# Altium schematic sheet DE-180824_1.SchDoc: DimmerBaseBoard
size A3; Author: eldar6776@hotmail.com; DrawnBy: Eldar Dedic; Organization: JUBERA d.o.o.; Address1: Braće Mulić 81; Address2: 71000 Sarajevo; Address3: Federacija BiH; Address4: Bosna i Hercegovina; DocumentNumber: DE-180824; Revision: 001; SheetNumber: 2; SheetTotal: 2; SPICEModelCacheBVBUIEPD: <root> / <DocumentId>BVBUIEPD</DocumentId> / </root>
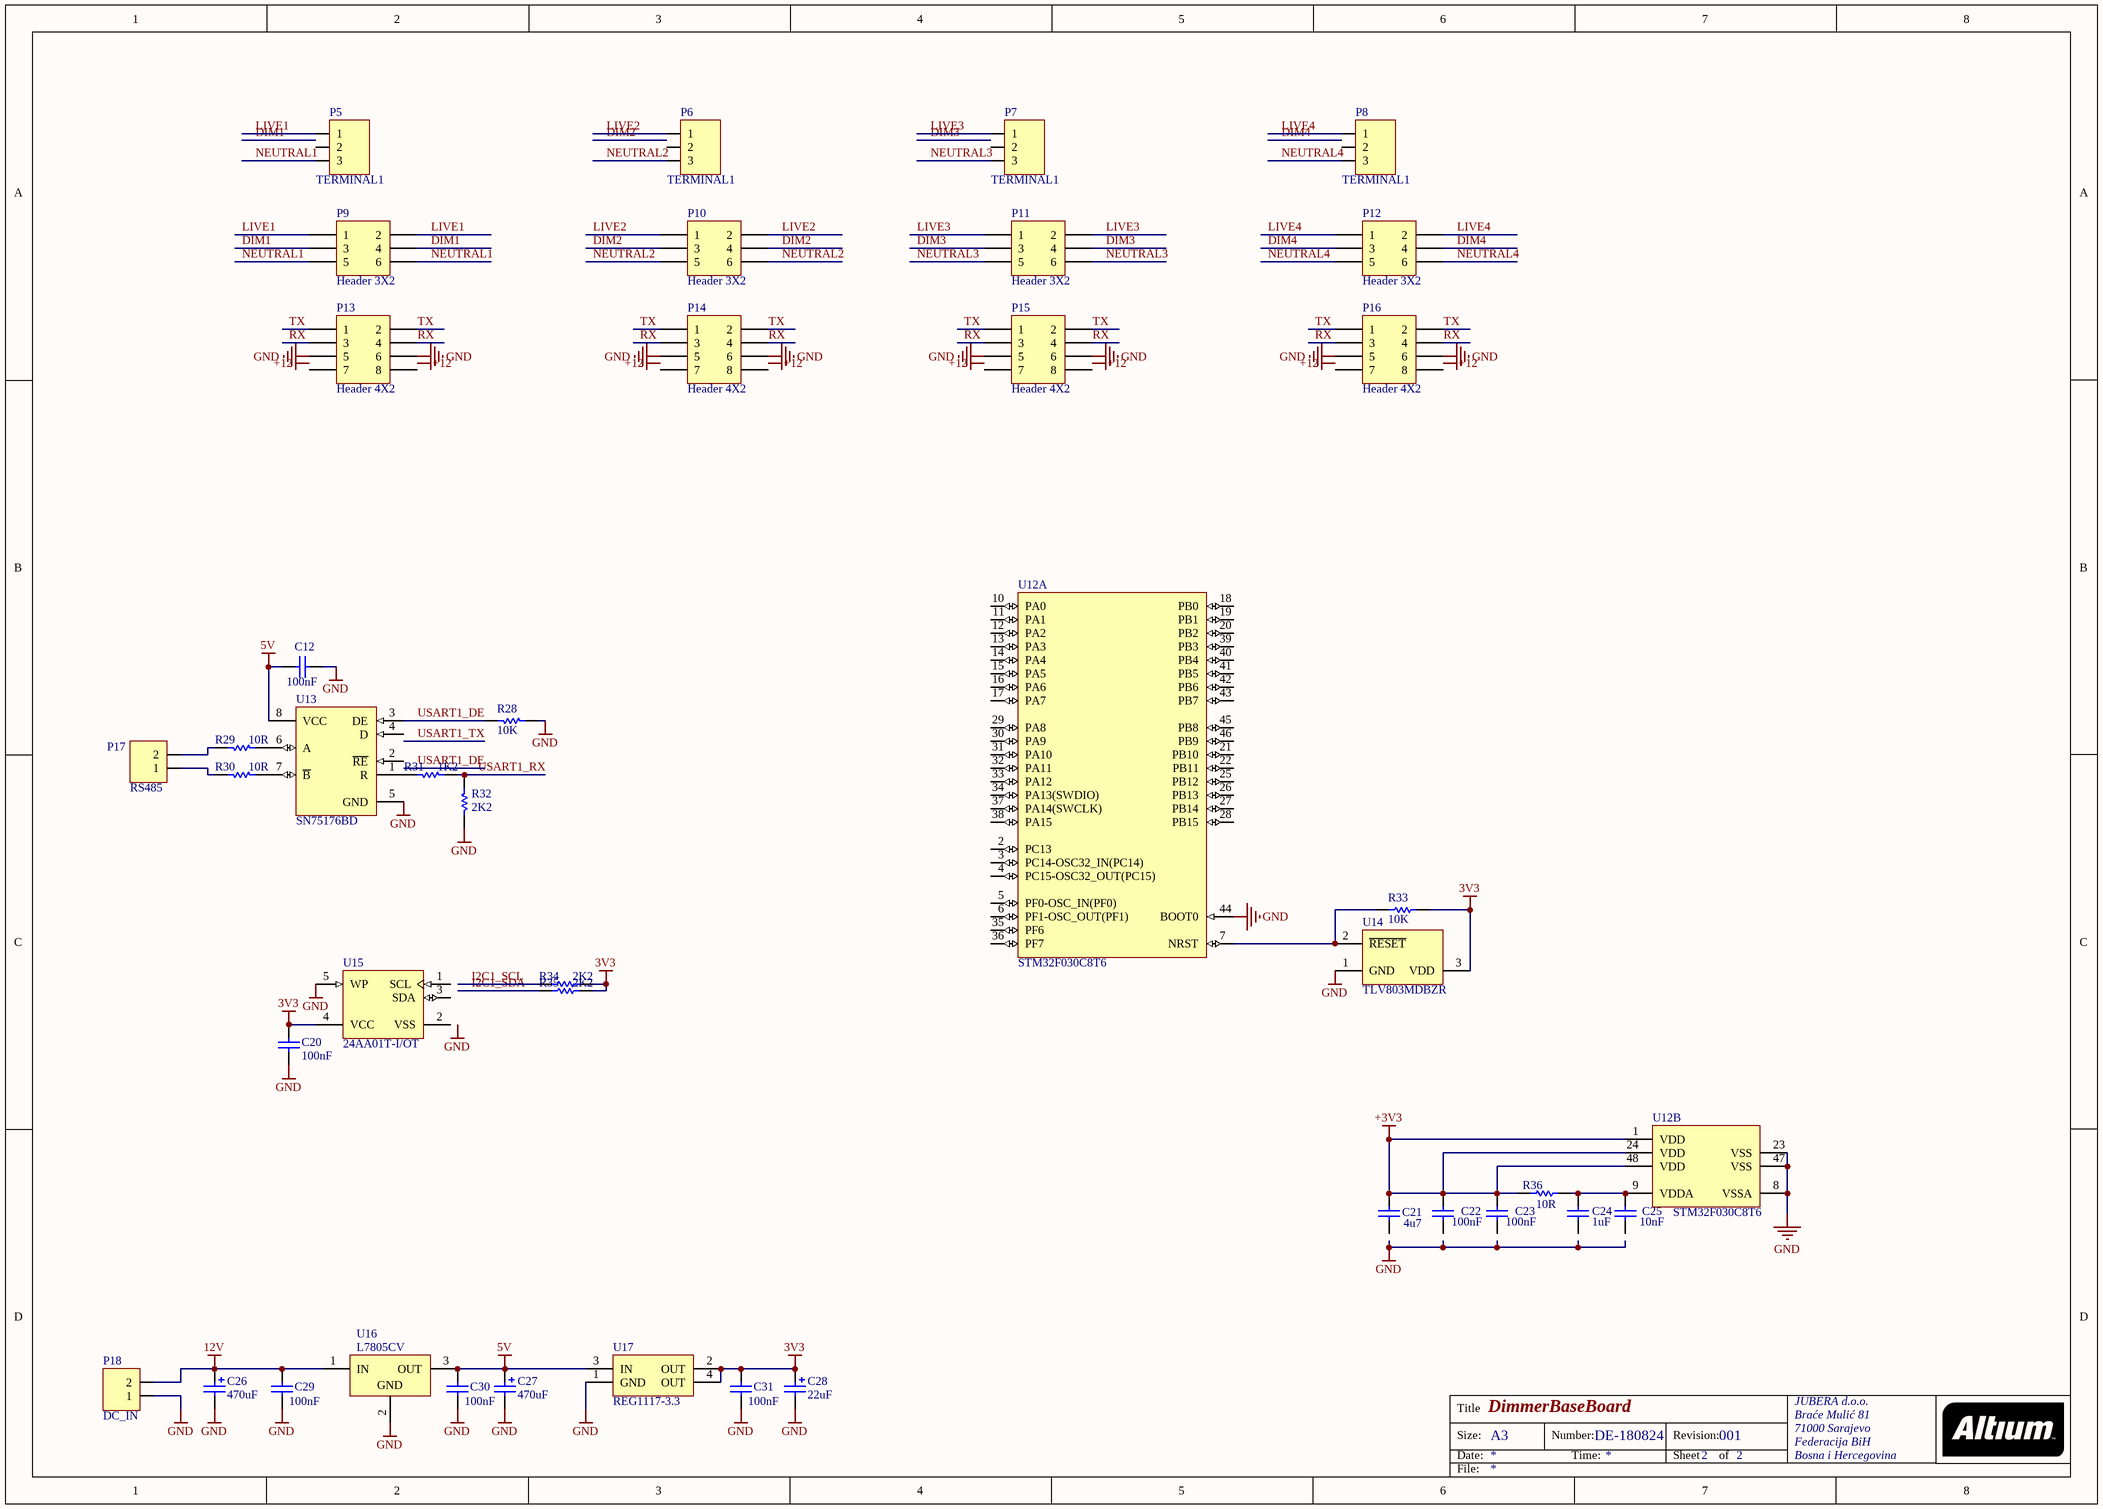
[diagram p0: DE-180824_1.SchDoc]

## Parts
C12  100nF  [0603]
C20  value 100nF  [0603]  (hidden comment: C0603)
C21  4u7  [0805]
C22  100nF  [0603]
C23  100nF  [0603]
C24  1uF  [0603]
C25  10nF  [0603]
C26  470uF  [CAPPR5-10X12.5]
C27  470uF  [CAPPR5-10X12.5]
C28  22uF  [CAPPR2-5X11]
C29  100nF  [0603]
C30  100nF  [0603]
C31  100nF  [0603]
P5  TERMINAL1  [3 PIN TERMINAL BLOCK  5mm]
P6  TERMINAL1  [3 PIN TERMINAL BLOCK  5mm]
P7  TERMINAL1  [3 PIN TERMINAL BLOCK  5mm]
P8  TERMINAL1  [3 PIN TERMINAL BLOCK  5mm]
P9  Header 3X2  [HDR2X3]
P10  Header 3X2  [HDR2X3]
P11  Header 3X2  [HDR2X3]
P12  Header 3X2  [HDR2X3]
P13  Header 4X2  [HDR2X4]
P14  Header 4X2  [HDR2X4]
P15  Header 4X2  [HDR2X4]
P16  Header 4X2  [HDR2X4]
P17  RS485  [TERMINAL BLOK 2]
P18  DC_IN  [TERMINAL BLOK 2]
R28  10K  [ERA-0603]
R29  10R  [ERA-0603]
R30  10R  [ERA-0603]
R31  1K2  [ERA-0603]
R32  2K2  [ERA-0603]
R33  10K  [ERA-0603]
R34  2K2  [ERA-0603]
R35  2K2  [ERA-0603]
R36  10R  [ERA-0603]
U12  STM32F030C8T6  [STM-LQFP48_N]  (parts A,B of 2)
U13  SN75176BD  [D008_N]
U14  TLV803MDBZR  [DBZ3_N]
U15  24AA01T-I/OT  [SOT-23-OT5_N]
U16  L7805CV  [TO220]
U17  REG1117-3.3  [ZZ311]

## Nets
3V3: C20.2 C28.1 C31.2 R33.2 R34.2 R35.2 U14.3(VDD) U15.4(VCC) U17.2(OUT) U17.4(OUT)
5V: C12.1 C27.1 C30.2 U13.8(VCC) U16.3(OUT) U17.3(IN)
12V: C26.1 C29.2 P18.2 U16.1(IN)
+3V3: C21.1 C22.1 C23.1 R36.2 U12.1(VDD) U12.24(VDD) U12.48(VDD)
GND: C12.2 C20.1 C26.2 C27.2 C28.2 C29.1 C30.1 C31.1 P13.5 P13.6 P14.5 P14.6 P15.5 P15.6 P16.5 P16.6 P18.1 R28.1 R32.2 U12.8(VSSA) U12.23(VSS) U12.44(BOOT0) U12.47(VSS) U13.5(GND) U14.1(GND) U15.5(WP) U16.2(GND) U17.1(GND)
DIM1: P9.3 P9.4
DIM2: P10.3 P10.4
DIM3: P11.3 P11.4
DIM4: P12.3 P12.4
I2C1_SCL: R34.1
I2C1_SDA: R35.1
LIVE1: P5.1 P9.1 P9.2
LIVE2: P6.1 P10.1 P10.2
LIVE3: P7.1 P11.1 P11.2
LIVE4: P8.1 P12.1 P12.2
NEUTRAL1: P5.3 P9.5 P9.6
NEUTRAL2: P6.3 P10.5 P10.6
NEUTRAL3: P7.3 P11.5 P11.6
NEUTRAL4: P8.3 P12.5 P12.6
RX: P13.3 P13.4 P14.3 P14.4 P15.3 P15.4 P16.3 P16.4
TX: P13.1 P13.2 P14.1 P14.2 P15.1 P15.2 P16.1 P16.2
USART1_DE: R28.2 U13.3(DE)
USART1_RX: R31.1 R32.1
NetC24_1: C24.1 C25.1 R36.1 U12.9(VDDA)
NetP17_1: P17.1 R30.1
NetP17_2: P17.2 R29.1
NetR29_2: R29.2 U13.6(A)
NetR30_2: R30.2 U13.7(~{B})
NetR31_2: R31.2 U13.1(R)
NetR33_1: R33.1 U12.7(NRST) U14.2(~{RESET})

Not connected (* = marked no-connect by the designer): C21 2; C22 2; C23 2; C24 2; C25 2; P5 2; P6 2; P7 2; P8 2; P13 7 8; P14 7 8; P15 7 8; P16 7 8; U12 2(PC13) 3(PC14-OSC32_IN(PC14)) 4(PC15-OSC32_OUT(PC15)) 5(PF0-OSC_IN(PF0)) 6(PF1-OSC_OUT(PF1)) 10(PA0) 11(PA1) 12(PA2) 13(PA3) 14(PA4) 15(PA5) 16(PA6) 17(PA7) 18(PB0) 19(PB1) 20(PB2) 21(PB10) 22(PB11) 25(PB12) 26(PB13) 27(PB14) 28(PB15) 29(PA8) 30(PA9) 31(PA10) 32(PA11) 33(PA12) 34(PA13(SWDIO)) 35(PF6) 36(PF7) 37(PA14(SWCLK)) 38(PA15) 39(PB3) 40(PB4) 41(PB5) 42(PB6) 43(PB7) 45(PB8) 46(PB9); U13 2(~{RE}) 4(D); U15 1(SCL) 2(VSS) 3(SDA)

## Notes on the sheet
- Labels drawn without touching a wire or pin: +12, GND
- Title
- Size:
- Date:
- A3
- Number:
- Time:
- Revision:
- Sheet
- of
- File:

## Library data of the parts
C12 C20 C22-C25 C29-C31 = C0603: Ceramic Chip Capacitor - Standard; Note: Footprint corresponds to dimensions for bulk cassette packaging. This case size has tightened tolerances.; Published: 17-Jul-2002; LatestRevisionDate: 19-Mar-2004; LatestRevisionNote: Silkscreen size reduced.; DatasheetDocument: Mar-2001; PackageDocument: Mar-2001; PackageReference: 0603; Publisher: Altium Limited; Code_JEITA: 0603; Code_IPC: 1608 [0603]; ComponentLink1Description: Manufacturer Link; ComponentLink1URL: http://www.kemet.com/; ComponentLink2Description: Datasheet; ComponentLink2URL: http://www.kemet.com/kemet/web/homepage/kechome.nsf/vapubfilesname/F3102TA.pdf/$file/F3102TA.pdf
  C12 C22 C23 C29-C31: Value: 100nF
  C24: Value: 1uF
  C25: Value: 10nF
C21 = C0805: Ceramic Chip Capacitor - Standard; Note: Footprint corresponds to dimensions for bulk cassette packaging. This case size has tightened tolerances.; Published: 17-Jul-2002; LatestRevisionDate: 19-Mar-2004; LatestRevisionNote: Silkscreen size reduced.; DatasheetDocument: Mar-2001; PackageDocument: Mar-2001; PackageReference: 0805; Publisher: Altium Limited; Code_JEITA: 0805; Code_IPC: 2012[0805]; ComponentLink1Description: Manufacturer Link; ComponentLink1URL: http://www.kemet.com/; ComponentLink2Description: Datasheet; ComponentLink2URL: http://www.kemet.com/kemet/web/homepage/kechome.nsf/vapubfilesname/F3102TA.pdf/$file/F3102TA.pdf; Value: 4u7
C26 C27 = EKA00DC347E00: Aluminum Electrolytic Capacitor, Radial Style with Long Leads: 470uF, 25V; Note: Refer to Manufacturer's Data Sheets for other lead formations; DrillSize: Nominal, Rounded To The Nearest 0.1mm; Published: 19-Mar-2004; DatasheetDocument: 20-Feb-2001; PackageReference: CAPPR5-10X12.5; Publisher: Altium Limited; ComponentLink1Description: Manufacturer Link; ComponentLink1URL: http://www.vishay.com/; ComponentLink2Description: Datasheet; ComponentLink2URL: http://www.vishay.com/docs/25014/eka.pdf; Value: 470uF
C28 = EKA00AA247F00: Aluminum Electrolytic Capacitor, Radial Style with Long Leads: 47uF, 35V; Note: Refer to Manufacturer's Data Sheets for other lead formations; DrillSize: Nominal, Rounded To The Nearest 0.1mm; Published: 19-Mar-2004; DatasheetDocument: 20-Feb-2001; PackageReference: CAPPR2-5X11; Publisher: Altium Limited; ComponentLink1Description: Manufacturer Link; ComponentLink1URL: http://www.vishay.com/; ComponentLink2Description: Datasheet; ComponentLink2URL: http://www.vishay.com/docs/25014/eka.pdf; Value: 47uF
P5-P8 = TERMINAL BLOK 3: 3 pinski terminal blok konektor
P9-P12 = Header 3X2: Header, 3-Pin, Dual row; LatestRevisionDate: 17-Jul-2002; LatestRevisionNote: Re-released for DXP Platform.; Publisher: Altium Limited
P13-P16 = Header 4X2: Header, 4-Pin, Dual row; LatestRevisionDate: 17-Jul-2002; LatestRevisionNote: Re-released for DXP Platform.; Publisher: Altium Limited
P17 P18 = TERMINAL BLOK 2: Terminal blok konektor 3,5 mm
R28-R32 = ERAV: Metal Film Thermosensitive Chip Resistor, 0.56 Ohm to 10k Ohm Range, 5% Tolerance, 0603 Size, 0.063 W; Note: If flow soldering, adjust pad width of PCB Footprint to 0.7 - 0.8 times the width of the resistor.; Published: 17-Dec-2003; LatestRevisionDate: 19-Mar-2004; LatestRevisionNote: Silkscreen size reduced.; PackageDocument: Mar-2003; PackageReference: ERA-0603; Publisher: Altium Limited; Code_IPC: 1608 [0603]; ComponentLink1Description: Manufacturer Link; ComponentLink1URL: http://www.panasonic.com/industrial/components/resistive_products.htm; ComponentLink2Description: Datasheet; ComponentLink2URL: http://www.panasonic.com/industrial/components/pdf/AOF0000CE1.pdf
R33-R35 = ERA3Y: Rectangular Thick Film Chip Resistor, 10 Ohm to 330k Ohm Range, 0.1% and 0.5% Tolerance, 0603 Size, 0.063 W; Note: If flow soldering, adjust pad width of PCB Footprint to 0.7 - 0.8 times the width of the resistor.; Published: 17-Dec-2003; LatestRevisionDate: 19-Mar-2004; LatestRevisionNote: Silkscreen size reduced.; PackageDocument: Mar-2003; PackageReference: ERA-0603; Publisher: Altium Limited; Code_IPC: 1608 [0603]; ComponentLink1Description: Manufacturer Link; ComponentLink1URL: http://www.panasonic.com/industrial/components/resistive_products.htm; ComponentLink2Description: Datasheet; ComponentLink2URL: http://www.panasonic.com/industrial/components/pdf/AOA0000CE8.pdf
R36 = ERA6Y: Rectangular Thick Film Chip Resistor, 10 Ohm to 1M Ohm Range, 0.1% and 0.5% Tolerance, 0805 Size, 0.1 W; Note: If flow soldering, adjust pad width of PCB Footprint to 0.7 - 0.8 times the width of the resistor.; Published: 17-Dec-2003; LatestRevisionDate: 19-Mar-2004; LatestRevisionNote: Silkscreen size reduced.; PackageDocument: Mar-2003; PackageReference: ERA-0805; Publisher: Altium Limited; Code_IPC: 2012 [0805]; ComponentLink1Description: Manufacturer Link; ComponentLink1URL: http://www.panasonic.com/industrial/components/resistive_products.htm; ComponentLink2Description: Datasheet; ComponentLink2URL: http://www.panasonic.com/industrial/components/pdf/AOA0000CE8.pdf
U12 = STM32F030C8T6: ARM Cortex-M0 32-bit MCU, 64 KB Flash, 8 KB Internal RAM, 39 I/Os, 48-pin LQFP, -40 to 85 degC, Tray; FLASH Size (Prog) (kB): 64; I/Os (High Current): 39; Internal RAM Size (kB): 8; Operating Frequency(F) (Processor speed) (MHz): 48; Supply Voltage(Vcc) min (V): 2.4; DatasheetVersion: Rev. 1; PackageVersion: Rev. 6, 06/2013; PackageReference: LQFP48; PackageDescription: 48-Pin Low Profile Quad Flat Package, 7 x 7 mm Body, 0.5 mm Pitch; Supplier 1: Digi-Key; Supplier Part Number 1: 497-14043-ND; Supplier 2: Newark; Supplier Part Number 2: 06X3647; Supplier 3: Mouser; Supplier Part Number 3: 511-STM32F030C8T6; Core: ARM Cortex-M0; Packing: Tray; Mounting Technology: Surface Mount; PartNumber: STM32F030C8T6; ComponentLink1Description: Manufacturer URL; ComponentLink1URL: http://www.st.com/web/en/home.html; ComponentLink2Description: Datasheet; ComponentLink2URL: http://www.st.com/st-web-ui/static/active/en/resource/technical/document/datasheet/DM00088500.pdf; ComponentLink3Description: Package Specification; ComponentLink3URL: http://www.st.com/st-web-ui/static/active/en/resource/technical/document/datasheet/DM00058181.pdf
U13 = SN75176BD: Differential Bus Transceiver; Note: Receiver Hysteresis of 50mV Typical; Published: 15-May-2002; LatestRevisionDate: 13-Apr-2006; LatestRevisionNote: IPC-7351 Footprint Added.; DatasheetVersion: Sep-1989; PackageVersion: Jan-1998; PackageReference: D008; Publisher: Altium Limited; PackageDescription: 8-Pin Small Outline Integrated Circuit 1.27 mm Pitch; Code_IPC: SOIC127P600-8; ComponentLink1Description: Manufacturer Link; ComponentLink1URL: http://www.ti.com/; ComponentLink2Description: Datasheet; ComponentLink2URL: http://www-s.ti.com/sc/ds/sn75176b.pdf
U14 = TLV803MDBZR: Voltage Supervisor with Active-Low, Open Drain Reset, 1 Supply Monitored, -40 to 125 degC, 3-pin SOT-23 (DBZ), Green (RoHS & no Sb/Br); Manufacturer: Texas Instruments; # of supplies monitored: 1; Iq(Typ)(uA): 9; Output Driver Type / Reset Output: Active-low, Open-drain; Rating: Catalog; Reset Threshold Accuracy(%): 2; SubFamily: Supervisor and Reset IC; Threshold Voltage 1 (typ)(Typ)(V): 4.38; Time Delay(ms): 200; VCC(Max)(V): 6; VCC(Min)(V): 1.1; DatasheetVersion: SBVS157B; PackageVersion: revB, Apr-2005; PackageReference: DBZ3; PackageDescription: 3-Pin Plastic Small-Outline Package, 0.95 mm Pitch, 2.4 mm Lead Span; Supplier 1: Digi-Key; Supplier Part Number 1: 296-29194-2-ND; Supplier 2: Digi-Key; Supplier Part Number 2: 296-29194-1-ND; Supplier 3: Digi-Key; Supplier Part Number 3: 296-29194-6-ND; Supplier 4: Newark; Supplier Part Number 4: 58T0286; Supplier 5: Mouser; Supplier Part Number 5: 595-TLV803MDBZR; Mounting Technology: Surface Mount; Code_JEDEC: TO-236-AB; PartNumber: TLV803MDBZR; ComponentLink1Description: Datasheet; ComponentLink1URL: http://www.ti.com/general/docs/lit/getliterature.tsp?genericPartNumber=TLV803M&fileType=pdf
U15 = 24AA01T-I/OT: 1Kbit, 400kHz, 1.8V, I2C Serial EEPROM, 5-Pin SOT-23, Industrial Temperature, Tape and Reel; Published: 29-Jan-2009; DatasheetVersion: revJ, Jan-2009; PackageVersion: revBB, Aug-2009; PackageReference: SOT-23-OT5; Publisher: Altium Limited; PackageDescription: 5-Lead Plastic Small Outline Transistor (OT) [SOT-23]; Supplier 1: Digi-Key; Supplier Part Number 1: 24AA01T-I/OTTR-ND; Supplier 2: Digi-Key; Supplier Part Number 2: 24AA01T-I/OTCT-ND; Supplier 3: Digi-Key; Supplier Part Number 3: 24AA01T-I/OTDKR-ND; Supplier 4: Farnell; Supplier Part Number 4: 1331269; Code_IPC: SOT23-5; ComponentLink1Description: Datasheet; ComponentLink1URL: http://ww1.microchip.com/downloads/en/DeviceDoc/21711J.pdf; ComponentLink2Description: Packaging Specification; ComponentLink2URL: http://www.microchip.com/stellent/groups/techpub_sg/documents/packagingspec/en012702.pdf; ComponentLink3Description: Microchip.com Home; ComponentLink3URL: http://www.microchip.com/
U16 = L7805CV: Positive Voltage Regulator, 5V, 3-Pin TO-220; DatasheetVersion: Nov-2011; PackageVersion: ver3.0; PackageReference: TO220; PackageDescription: TO, Thru-Hole, Vertical, Heatsink Mounted; 3 In-Line Leads; Pitch 2.54 mm; PartNumber: L7805CV; ComponentLink1Description: Manufacturer URL; ComponentLink1URL: http://www.st.com; ComponentLink2Description: Datasheet; ComponentLink2URL: http://www.st.com/internet/com/TECHNICAL_RESOURCES/TECHNICAL_LITERATURE/DATASHEET/CD00000444.pdf; ComponentLink3Description: Package Specification; ComponentLink3URL: http://www.st.com/internet/com/TECHNICAL_RESOURCES/TECHNICAL_LITERATURE/PACKAGE_INFORMATION/CD00004649.pdf
U17 = REG1117-3.3: 800mA and 1A Low Dropout Positive Regulator 2.85V, 3.3V, 5V, and Adjustable; Published: 8-Jun-2000; LatestRevisionDate: 17-Jul-2002; LatestRevisionNote: Re-released for DXP Platform.; DatasheetVersion: Sep-1997; PackageVersion: revC; PackageReference: ZZ311; Publisher: Altium Limited; PackageDescription: SOT-223/SC-73; 4 Leads; Body 6.7 x 7.3 mm, inc. leads (LxW max); ComponentLink1Description: Manufacturer Link; ComponentLink1URL: http://www.ti.com/; ComponentLink2Description: Datasheet; ComponentLink2URL: http://www-s.ti.com/sc/ds/REG1117.pdf